# Altium schematic sheet Main.SchDoc
size A4; SheetNumber: 1; SheetTotal: 7
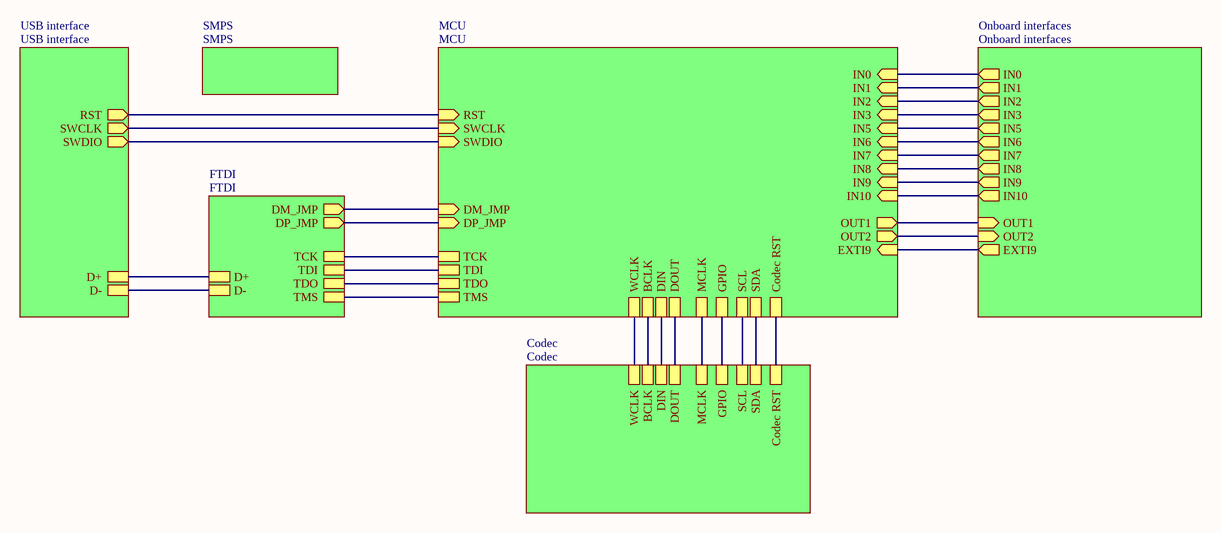
[diagram p0: Main.SchDoc]

## Sub-sheets
Codec = Codec: WCLK, BCLK, DIN, DOUT, MCLK, GPIO, SCL, SDA, Codec RST
FTDI = FTDI: D+, D-, TCK, TDI, TDO, TMS, DM_JMP (out), DP_JMP (out)
MCU = MCU: TCK, TDI, TDO, TMS, WCLK, BCLK, DIN, DOUT, MCLK, GPIO, SCL, SDA, Codec RST, DM_JMP (in), DP_JMP (in), RST (in), SWCLK (in), SWDIO (in), IN0 (in), IN1 (in), IN2 (in), IN3 (in), IN5 (in), IN6 (in), IN7 (in), IN8 (in), IN9 (in), IN10 (in), OUT1 (out), OUT2 (out), EXTI9 (in)
Onboard interfaces = Onboard interfaces: IN0 (out), IN1 (out), IN2 (out), IN3 (out), IN5 (out), IN6 (out), IN7 (out), IN8 (out), IN9 (out), IN10 (out), OUT1 (in), OUT2 (in), EXTI9 (out)
SMPS = SMPS: no entries
USB interface = USB interface: D+, D-, RST (out), SWCLK (out), SWDIO (out)

## Nets
(unnamed): sheet MCU/TCK, sheet FTDI/TCK
(unnamed): sheet MCU/TDI, sheet FTDI/TDI
(unnamed): sheet MCU/TDO, sheet FTDI/TDO
(unnamed): sheet MCU/TMS, sheet FTDI/TMS
(unnamed): sheet MCU/WCLK, sheet Codec/WCLK
(unnamed): sheet MCU/BCLK, sheet Codec/BCLK
(unnamed): sheet MCU/DIN, sheet Codec/DIN
(unnamed): sheet MCU/DOUT, sheet Codec/DOUT
(unnamed): sheet MCU/MCLK, sheet Codec/MCLK
(unnamed): sheet MCU/GPIO, sheet Codec/GPIO
(unnamed): sheet MCU/SCL, sheet Codec/SCL
(unnamed): sheet MCU/SDA, sheet Codec/SDA
(unnamed): sheet MCU/Codec RST, sheet Codec/Codec RST
(unnamed): sheet MCU/DM_JMP, sheet FTDI/DM_JMP
(unnamed): sheet MCU/DP_JMP, sheet FTDI/DP_JMP
(unnamed): sheet MCU/RST, sheet USB interface/RST
(unnamed): sheet MCU/SWCLK, sheet USB interface/SWCLK
(unnamed): sheet MCU/SWDIO, sheet USB interface/SWDIO
(unnamed): sheet MCU/IN0, sheet Onboard interfaces/IN0
(unnamed): sheet MCU/IN1, sheet Onboard interfaces/IN1
(unnamed): sheet MCU/IN2, sheet Onboard interfaces/IN2
(unnamed): sheet MCU/IN3, sheet Onboard interfaces/IN3
(unnamed): sheet MCU/IN5, sheet Onboard interfaces/IN5
(unnamed): sheet MCU/IN6, sheet Onboard interfaces/IN6
(unnamed): sheet MCU/IN7, sheet Onboard interfaces/IN7
(unnamed): sheet MCU/IN8, sheet Onboard interfaces/IN8
(unnamed): sheet MCU/IN9, sheet Onboard interfaces/IN9
(unnamed): sheet MCU/IN10, sheet Onboard interfaces/IN10
(unnamed): sheet MCU/OUT1, sheet Onboard interfaces/OUT1
(unnamed): sheet MCU/OUT2, sheet Onboard interfaces/OUT2
(unnamed): sheet MCU/EXTI9, sheet Onboard interfaces/EXTI9
(unnamed): sheet USB interface/D+, sheet FTDI/D+
(unnamed): sheet USB interface/D-, sheet FTDI/D-